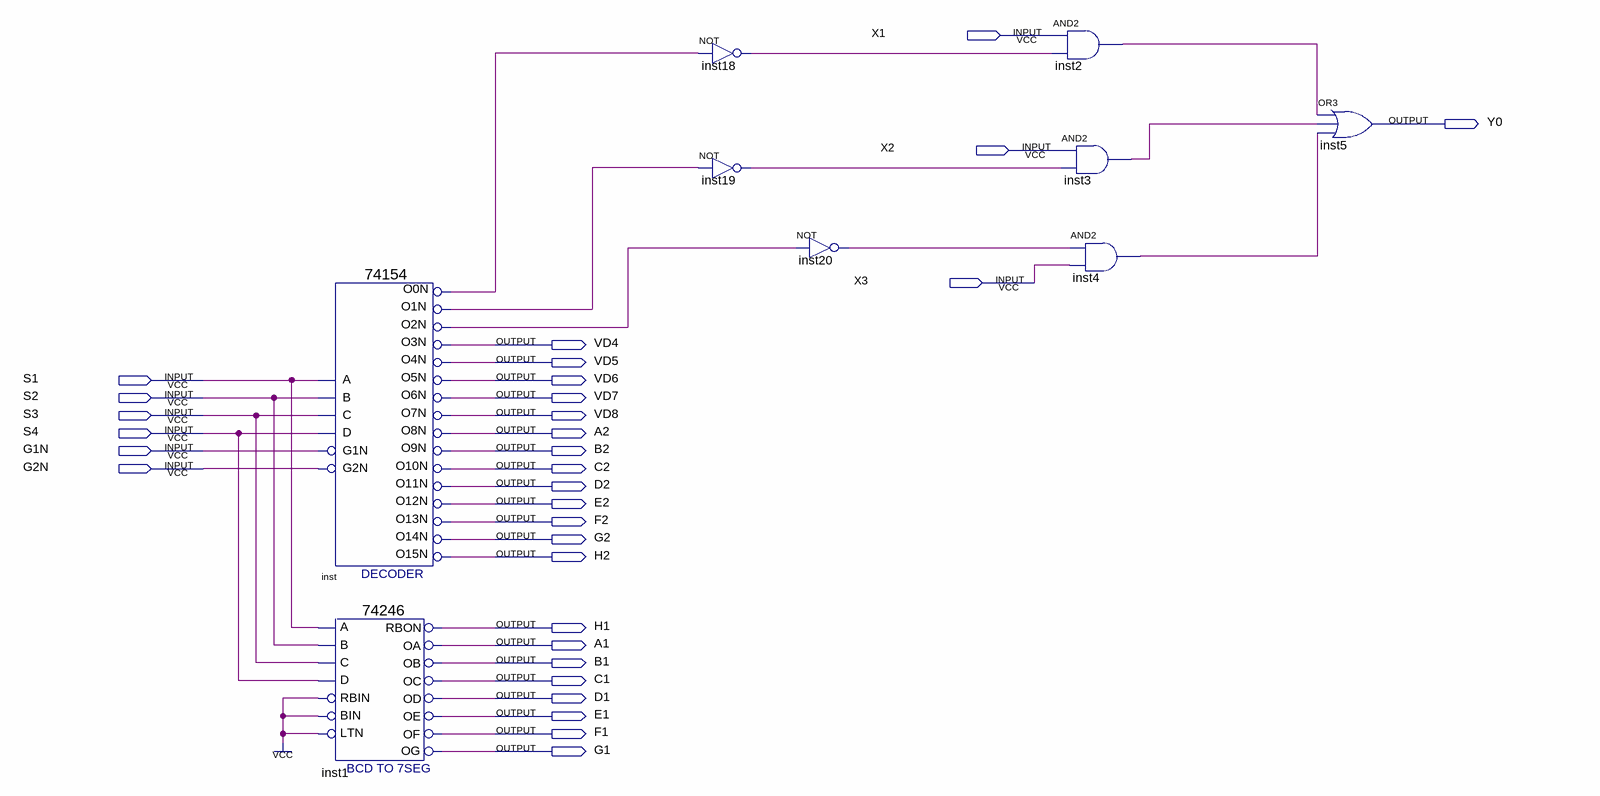
[diagram p0: schematic sheet]
// Quartus schematic CMB3.bdf as structural Verilog: 9 symbols, 31 pins
module CMB3 (
  input  X1,
  input  X2,
  input  X3,
  input  S1,
  input  S2,
  input  S3,
  input  S4,
  input  G1N,
  input  G2N,
  output Y0,
  output VD4,
  output VD5,
  output VD6,
  output VD7,
  output VD8,
  output A2,
  output B2,
  output C2,
  output D2,
  output E2,
  output F2,
  output G2,
  output H2,
  output H1,
  output A1,
  output B1,
  output C1,
  output D1,
  output E1,
  output F1,
  output G1
);

  wire inst2_out, inst3_out, inst4_out, inst18_out, inst19_out, inst20_out, inst_o0n, inst_o1n, inst_o2n;

  \74154  inst (
    .C(S3), .D(S4), .B(S2), .A(S1), .G1N(G1N), .G2N(G2N), .O0N(inst_o0n), .O12N(E2), .O15N(H2), .O10N(C2),
    .O11N(D2), .O1N(inst_o1n), .O13N(F2), .O14N(G2), .O4N(VD5), .O3N(VD4), .O2N(inst_o2n), .O7N(VD8),
    .O6N(VD7), .O5N(VD6), .O9N(B2), .O8N(A2));
  \74246  inst1 (
    .B(S2), .A(S1), .RBIN(1'b1), .D(S4), .C(S3), .LTN(1'b1), .BIN(1'b1), .OD(D1), .RBON(H1), .OC(C1),
    .OB(B1), .OE(E1), .OF(F1), .OA(A1), .OG(G1));
  not inst18 (inst18_out, inst_o0n);
  not inst19 (inst19_out, inst_o1n);
  not inst20 (inst20_out, inst_o2n);
  and inst2 (inst2_out, X1, inst18_out);
  and inst3 (inst3_out, X2, inst19_out);
  and inst4 (inst4_out, inst20_out, X3);
  or inst5 (Y0, inst2_out, inst3_out, inst4_out);
endmodule
